# EAGLE schematic Main (EAGLE 9.1.3)
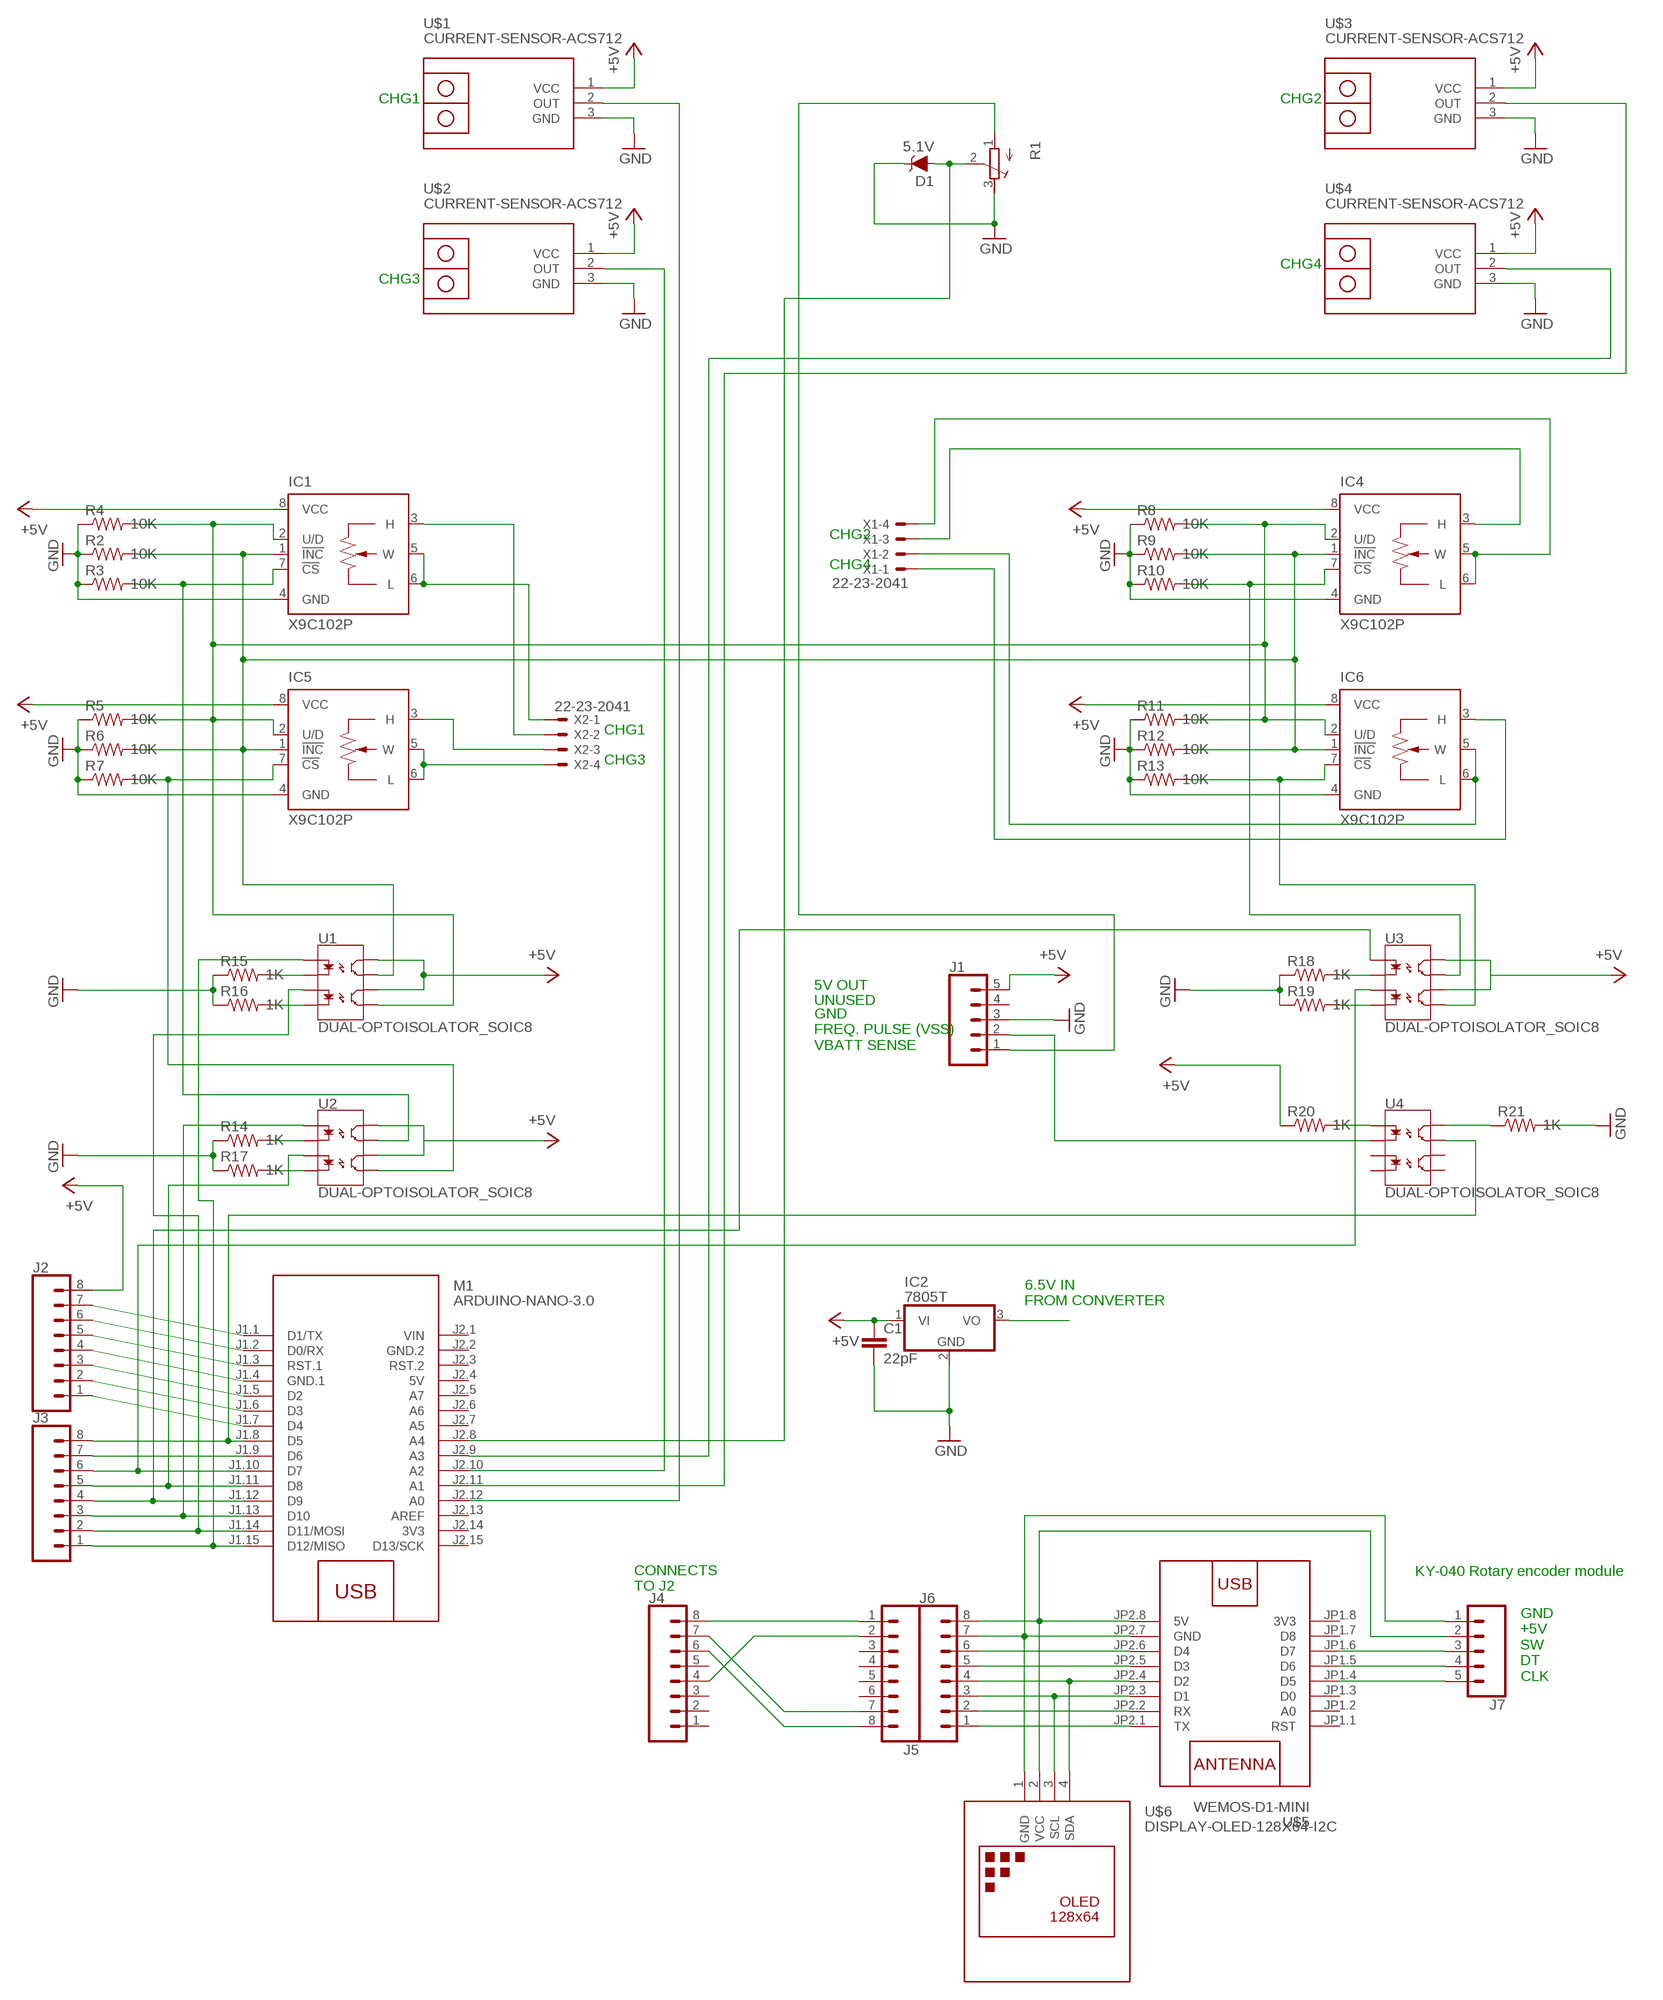
[diagram p0: schematic, sheet 1]

## Parts
C1  22pF  22PF-PTH-2.54MM-200V-5%  [CAP-PTH-2.54]
D1  5.1V  DIODE-ZENER-MMSZ5232BS  [SOD-323]
IC1  X9C102P  [DIL08]
IC2  7805T  [TO220H]
IC4  X9C102P  [DIL08]
IC5  X9C102P  [DIL08]
IC6  X9C102P  [DIL08]
J1  CONN_05PTH_LONGPADS  [1X05_LONGPADS]
J2  CONN_08LONGPADS  [1X08_LONGPADS]
J3  CONN_08LONGPADS  [1X08_LONGPADS]
J4  CONN_08LONGPADS  [1X08_LONGPADS]
J5  CONN_08LONGPADS  [1X08_LONGPADS]
J6  CONN_08LONGPADS  [1X08_LONGPADS]
J7  CONN_05PTH_LONGPADS  [1X05_LONGPADS]
M1  ARDUINO-NANO-3.0  [ARDUINO-NANO-3.0]
R1  R-TRIMM64W  [RTRIM64W]
R2  10K  R-US_0204/7  [0204/7]
R3  10K  R-US_0204/7  [0204/7]
R4  10K  R-US_0204/7  [0204/7]
R5  10K  R-US_0204/7  [0204/7]
R6  10K  R-US_0204/7  [0204/7]
R7  10K  R-US_0204/7  [0204/7]
R8  10K  R-US_0204/7  [0204/7]
R9  10K  R-US_0204/7  [0204/7]
R10  10K  R-US_0204/7  [0204/7]
R11  10K  R-US_0204/7  [0204/7]
R12  10K  R-US_0204/7  [0204/7]
R13  10K  R-US_0204/7  [0204/7]
R14  1K  R-US_0204/7  [0204/7]
R15  1K  R-US_0204/7  [0204/7]
R16  1K  R-US_0204/7  [0204/7]
R17  1K  R-US_0204/7  [0204/7]
R18  1K  R-US_0204/7  [0204/7]
R19  1K  R-US_0204/7  [0204/7]
R20  1K  R-US_0204/7  [0204/7]
R21  1K  R-US_0204/7  [0204/7]
U1  DUAL-OPTOISOLATOR_SOIC8  [SO08]
U2  DUAL-OPTOISOLATOR_SOIC8  [SO08]
U3  DUAL-OPTOISOLATOR_SOIC8  [SO08]
U4  DUAL-OPTOISOLATOR_SOIC8  [SO08]
U$1  CURRENT-SENSOR-ACS712  [CURRENT-SENSOR-ACS712]
U$2  CURRENT-SENSOR-ACS712  [CURRENT-SENSOR-ACS712]
U$3  CURRENT-SENSOR-ACS712  [CURRENT-SENSOR-ACS712]
U$4  CURRENT-SENSOR-ACS712  [CURRENT-SENSOR-ACS712]
U$5  WEMOS-D1-MINI  [WEMOS-D1-MINI]
U$6  DISPLAY-OLED-128X64-I2C  [DISPLAY-OLED-128X64-I2C]
X1  22-23-2041  [22-23-2041]
X2  22-23-2041  [22-23-2041]

## Nets
+5V: C1.1 IC1.8(VCC) IC2.1(VI) IC4.8(VCC) IC5.8(VCC) IC6.8(VCC) J1.5 J2.8 R20.1 U1.6(CL2) U1.8(CL1) U2.6(CL2) U2.8(CL1) U3.6(CL2) U3.8(CL1) U$1.1(VCC) U$2.1(VCC) U$3.1(VCC) U$4.1(VCC)
GND: C1.2 D1.C IC1.4(GND) IC2.2(GND) IC4.4(GND) IC5.4(GND) IC6.4(GND) J1.3 R1.3(E) R2.1 R3.1 R4.1 R5.1 R6.1 R7.1 R8.1 R9.1 R10.1 R11.1 R12.1 R13.1 R14.1 R15.1 R16.1 R17.1 R18.1 R19.1 R21.2 U$1.3(GND) U$2.3(GND) U$3.3(GND) U$4.3(GND)
N$1: IC1.7(!CS) R3.2 U2.7(EM1)
N$2: IC1.1(!INC) IC4.1(!INC) IC5.1(!INC) IC6.1(!INC) R2.2 R6.2 R9.2 R12.2 U1.7(EM1)
N$3: R15.2 U1.2(C1)
N$4: IC1.5(W) IC1.6(L) X2.1
N$5: R16.2 U1.4(C2)
N$6: IC5.7(!CS) R7.2 U2.5(EM2)
N$7: IC1.3(H) X2.2
N$8: IC1.2(U/D) IC4.2(U/D) IC5.2(U/D) IC6.2(U/D) R4.2 R5.2 R8.2 R11.2 U1.5(EM2)
N$9: IC5.5(W) IC5.6(L) X2.4
N$10: IC5.3(H) X2.3
N$11: R14.2 U2.2(C1)
N$12: R17.2 U2.4(C2)
N$13: IC4.5(W) IC4.6(L) X1.4
N$14: IC6.7(!CS) R13.2 U3.5(EM2)
N$15: R18.2 U3.2(C1)
N$16: R19.2 U3.4(C2)
N$17: IC6.5(W) IC6.6(L) X1.2
N$18: IC4.3(H) X1.3
N$19: IC6.3(H) X1.1
N$20: IC4.7(!CS) R10.2 U3.7(EM1)
N$21: J1.2 U4.2(C1)
N$22: J1.1 R1.1(A)
N$23: D1.A M1.J2.8(A4) R1.2(S)
N$24: J3.8 M1.J1.8(D5) U4.7(EM1)
N$25: R20.2 U4.1(A1)
N$26: R21.1 U4.8(CL1)
N$27: J2.1 M1.J1.7(D4)
N$28: J2.2 M1.J1.6(D3)
N$29: J2.3 M1.J1.5(D2)
N$30: J2.4 M1.J1.4(GND.1)
N$31: J2.5 M1.J1.3(RST.1)
N$32: J2.6 M1.J1.2(D0/RX)
N$33: J2.7 M1.J1.1(D1/TX)
N$34: J3.1 M1.J1.15(D12/MISO) U1.1(A1)
N$35: J3.2 M1.J1.14(D11/MOSI) U1.3(A2)
N$36: J3.3 M1.J1.13(D10) U2.1(A1)
N$37: J3.4 M1.J1.12(D9) U3.1(A1)
N$38: J3.5 M1.J1.11(D8) U2.3(A2)
N$39: J3.6 M1.J1.10(D7) U3.3(A2)
N$40: J3.7 M1.J1.9(D6)
N$41: M1.J2.12(A0) U$1.2(OUT)
N$42: M1.J2.10(A2) U$2.2(OUT)
N$43: M1.J2.11(A1) U$3.2(OUT)
N$44: M1.J2.9(A3) U$4.2(OUT)
N$45: J6.1 U$5.JP2.1(TX)
N$46: IC2.3(VO)
N$47: J6.2 U$5.JP2.2(RX)
N$48: J6.3 U$5.JP2.3(D1) U$6.3(SCL)
N$49: J6.4 U$5.JP2.4(D2) U$6.4(SDA)
N$50: J6.5 U$5.JP2.5(D3)
N$51: J6.6 U$5.JP2.6(D4)
N$52: J6.7 J7.1 U$5.JP2.7(GND) U$6.1(GND)
N$53: J6.8 J7.2 U$5.JP2.8(5V) U$6.2(VCC)
N$54: J4.8 J5.1
N$55: J4.4 J5.2
N$56: J4.7 J5.7
N$57: J4.6 J5.8
N$58: J7.3 U$5.JP1.6(D7)
N$59: J7.4 U$5.JP1.5(D6)
N$60: J7.5 U$5.JP1.4(D5)
Unconnected: J1.4 J4.1 J4.2 J4.3 J4.5 J5.3 J5.4 J5.5 J5.6 M1.J2.3(RST.2) M1.J2.5(A7) M1.J2.6(A6) M1.J2.7(A5) M1.J2.13(AREF) M1.J2.15(D13/SCK) U4.3(A2) U4.4(C2) U4.5(EM2) U4.6(CL2) U$5.JP1.1(RST) U$5.JP1.2(A0) U$5.JP1.3(D0) U$5.JP1.7(D8)

## Notes on the sheet
- CHG1 | CHG2
- CHG4
- CHG3
- CHG2
- CHG4
- CHG1
- CHG3
- 5V OUT
- UNUSED
- GND
  FREQ. PULSE (VSS)
  VBATT SENSE
- 6.5V IN
  FROM CONVERTER
- KY-040 Rotary encoder module
- CONNECTS
  TO J2
- GND
  +5V
  SW
  DT
  CLK

## Power pins joined to a net without a drawn wire
3V3: M1.J2.14(3V3) U$5.JP1.8(3V3)
5V: M1.J2.4(5V)
GND.2: M1.J2.2(GND.2)
VIN: M1.J2.1(VIN)

## Library data of the parts
C1 = SparkFun-Capacitors:22PF: 22pF ceramic capacitors A capacitor is a passive two-terminal electrical component used to store electrical energy temporarily in an electric field.; PROD_ID: CAP-09128
D1 = SparkFun-DiscreteSemi:DIODE-ZENER: Zener Diode A Zener diode allows current to flow from its anode to its cathode like a normal semiconductor diode, but it also permits current to flow in the reverse direction when its "Zener voltage" is reached. - WIkipedia; PROD_ID: DIO-12442; VALUE: 5.6V
IC1 IC4-IC6 = pot-xicor:X9C102*: Digital POTENTIOMETER; MF: INTERSIL; MPN: X9C102P; OC_FARNELL: 1216104; OC_NEWARK: 51J6928
IC2 = linear:78*: Positive VOLTAGE REGULATOR Source: http://cache.national.com/ds/LM/LM78L05.pdf http://www.fairchildsemi.com/ds/LM/LM7805.pdf
J1 J7 = SparkFun-Connectors:CONN_05: Multi connection point. Often used as Generic Header-pin footprint for 0.1 inch spaced/style header connections On any of the 0.1 inch spaced packages, you can populate with these: Break Away Headers - Straight <https://www.sparkfun.com/products/116> (PRT-00116) Break Away Male Headers - Right Angle <https://www.sparkfun.com/products/553> (PRT-00553) Female Headers <https://www.sparkfun.com/products/115> (PRT-00115) Break Away Headers - Machine Pin <https://www.sparkfun.com/products/117> (PRT-00117) Break Away Female Headers - Swiss Machine Pin <https://www.sparkfun.com/products/743> (PRT-00743) For SCREWTERMINALS and SPRING TERMINALS visit here: Screw Terimnals on SparkFun.com <https://www.sparkfun.com/search/results?term=Screw+Terminals> (5mm/3.5mm/2.54mm spacing) This device is also useful as a general connection point to wire up your design to another part of your project. Our various solder wires solder well into these plated through hole pads. Hook-Up Wire - Assortment (Stranded, 22 AWG) <https://www.sparkfun.com/products/11375> (PRT-11375) Hook-Up Wire - Assortment (Solid Core, 22 AWG) <https://www.sparkfun.com/products/11367> (PRT-11367) View the entire wire category on our website here <https://www.sparkfun.com/categories/141> Special notes: Molex polarized connector foot print use with SKU : PRT-08231 with associated crimp pins and housings. 1MM SMD Version SKU: PRT-10208
J2-J6 = SparkFun-Connectors:CONN_08: Multi connection point. Often used as Generic Header-pin footprint for 0.1 inch spaced/style header connections On any of the 0.1 inch spaced packages, you can populate with these: Break Away Headers - Straight <https://www.sparkfun.com/products/116> (PRT-00116) Break Away Male Headers - Right Angle <https://www.sparkfun.com/products/553> (PRT-00553) Female Headers <https://www.sparkfun.com/products/115> (PRT-00115) Break Away Headers - Machine Pin <https://www.sparkfun.com/products/117> (PRT-00117) Break Away Female Headers - Swiss Machine Pin <https://www.sparkfun.com/products/743> (PRT-00743) Arduino Stackable Header - 8 Pin <https://www.sparkfun.com/products/9279> (PRT-09279) For SCREWTERMINALS and SPRING TERMINALS visit here: Screw Terimnals on SparkFun.com <https://www.sparkfun.com/search/results?term=Screw+Terminals> (5mm/3.5mm/2.54mm spacing) This device is also useful as a general connection point to wire up your design to another part of your project. Our various solder wires solder well into these plated through hole pads. Hook-Up Wire - Assortment (Stranded, 22 AWG) <https://www.sparkfun.com/products/11375> (PRT-11375) Hook-Up Wire - Assortment (Solid Core, 22 AWG) <https://www.sparkfun.com/products/11367> (PRT-11367) View the entire wire category on our website here <https://www.sparkfun.com/categories/141> Special notes: Molex polarized connector foot print use with SKU : PRT-08231 with associated crimp pins and housings. 1MM SMD Version SKU: PRT-10208 NOTES ON THE VARIANTS LOCK and LOCK_LONGPADS... This footprint was designed to help hold the alignment of a through-hole component (i.e. 6-pin header) while soldering it into place. You may notice that each hole has been shifted either up or down by 0.005 of an inch from it's more standard position (which is a perfectly straight line). This slight alteration caused the pins (the squares in the middle) to touch the edges of the holes. Because they are alternating, it causes a "brace" to hold the component in place. 0.005 has proven to be the perfect amount of "off-center" position when using our standard breakaway headers. Although looks a little odd when you look at the bare footprint, once you have a header in there, the alteration is very hard to notice. Also,if you push a header all the way into place, it is covered up entirely on the bottom side.
M1 = diy-modules:ARDUINO-NANO-3.0: Arduino Nano 3.0 and compatible devices More details available here: https://www.arduino.cc/en/Main/ArduinoBoardNano Click here to find device on ebay.com <http://www.ebay.com/sch/arduino+nano>
R1 = resistor:R-TRIMM: Trimm resistor
R2-R21 = resistor:R-US_: RESISTOR, American symbol
U1-U4 = SparkFun-DiscreteSemi:DUAL-OPTOISOLATOR: Optocoupler, Phototransistor Output, Dual Channel Optically coupled pairs with a gallium arsenide infrared LED and a silicon NPN phototransistor. Signal information, including a DC level, can be transmitted by the device while maintaining a high degree of electrical isolation between input and output. Datasheet <https://www.sparkfun.com/datasheets/Components/SMD/ild205t.pdf> SparkFun Products: SparkFun Opto-isolator Breakout <https://www.sparkfun.com/products/9118>; PROD_ID: IC-09076
U$1-U$4 = diy-modules:CURRENT-SENSOR-ACS712: Isolated Bipolar Current Sensors based on ACS712 chip More details available here: http://embedded-lab.com/blog/a-brief-overview-of-allegro-acs712-current-sensor-part-1/ Click here to find device on ebay.com <http://www.ebay.com/sch/acs712+module> Note: There are many available versions with different pinout. Please check before use
U$5 = diy-modules:WEMOS-D1-MINI: WEMOS D1 mini: Mini Wi-Fi Board based on ESP-8266 device More details can be found here: https://www.wemos.cc/product/d1-mini.html Click here to find device on ebay.com <http://www.ebay.com/sch/wemos+d1+mini+nodemcu>
U$6 = diy-modules:DISPLAY-OLED-128X64-I2C: 128x64 Dot Matrix OLED Module based on SSD1306 chip Variant with I2C interface More details available here: http://www.instructables.com/id/Monochrome-096-i2c-OLED-display-with-arduino-SSD13/ SSD1306 datasheet: https://cdn-shop.adafruit.com/datasheets/SSD1306.pdf Click here to find device on ebay.com <http://www.ebay.com/sch/oled+display+128x64+iic> Note: There are two variants: I2C and SPI. Search for the proper version.
X1 X2 = con-molex:22-23-2041: .100" (2.54mm) Center Header - 4 Pin; MF: MOLEX; MPN: 22-23-2041; OC_FARNELL: 1462920; OC_NEWARK: 38C0355